# EasyEDA schematic SCH_10.1HD_2022-05-30.json
TITLE: Sheet_1; REV: 1.0; Date: 2022-05-30; Sheet: 1/1; Company: Your Company
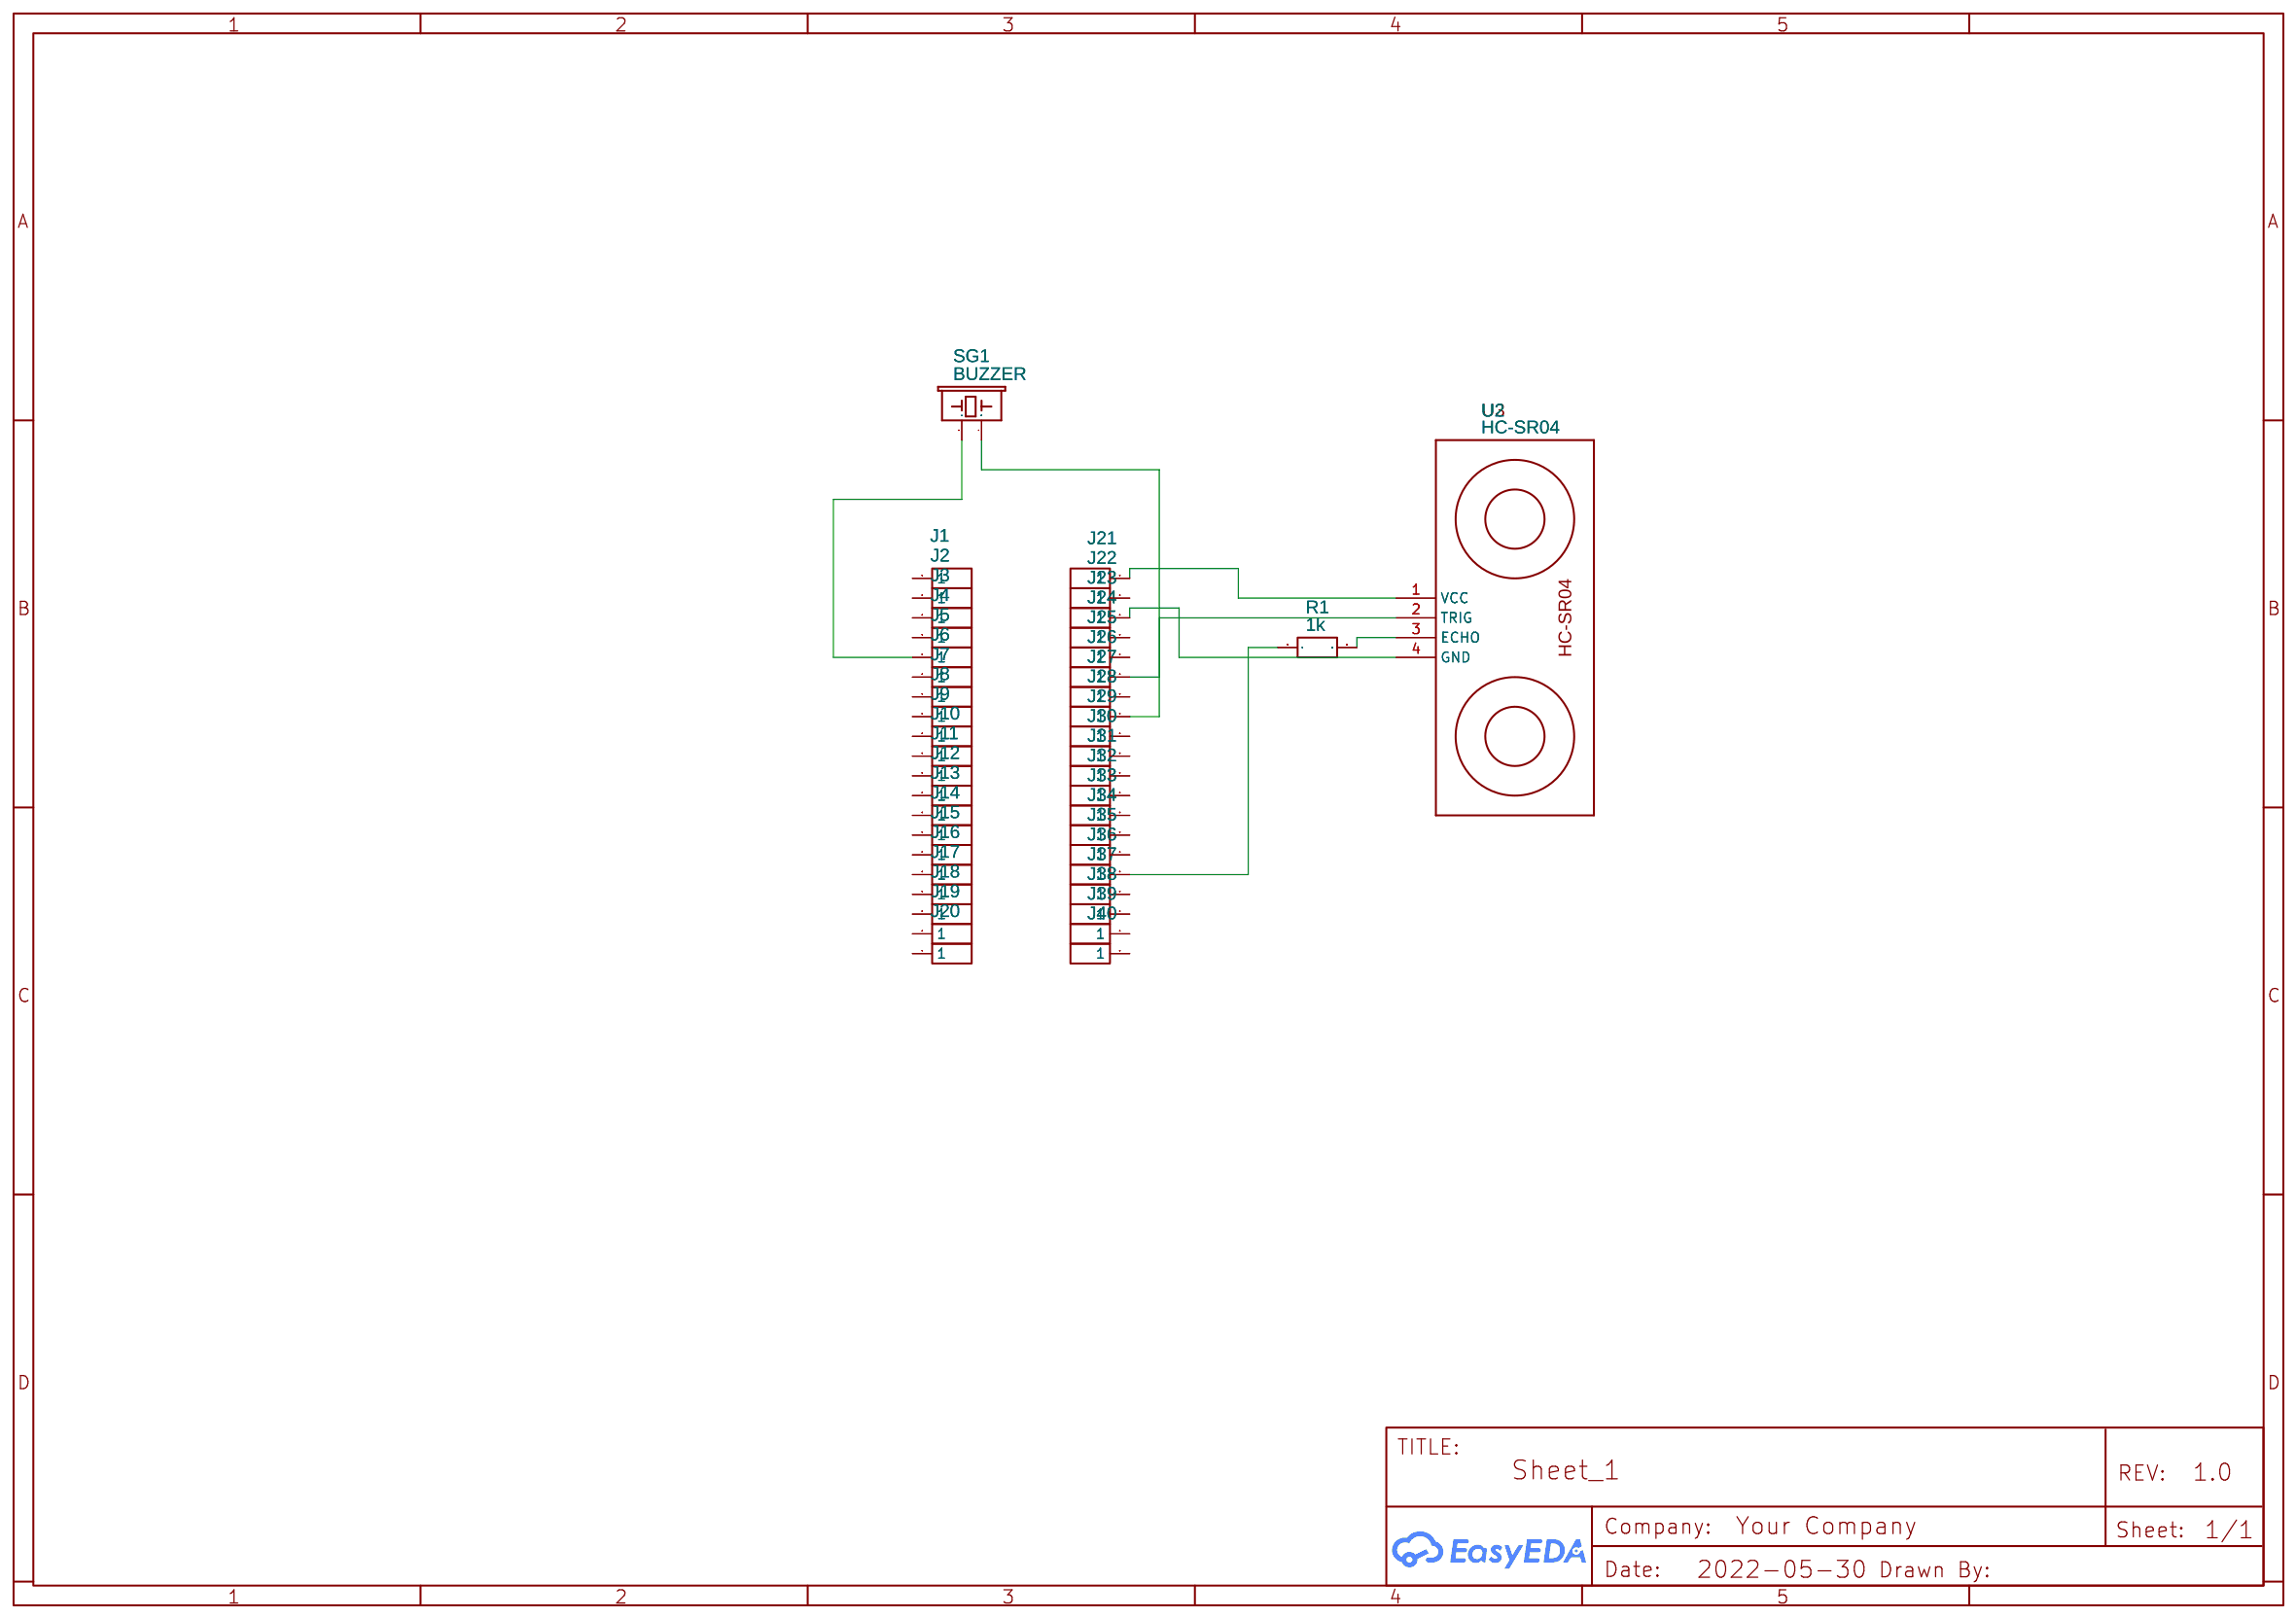
[diagram p0: schematic sheet]

## Parts
J1  HDR-M-2.54_1x1  [HDR-M-2.54_1X1]
J2  HDR-M-2.54_1x1  [HDR-M-2.54_1X1]
J3  HDR-M-2.54_1x1  [HDR-M-2.54_1X1]
J4  HDR-M-2.54_1x1  [HDR-M-2.54_1X1]
J5  HDR-M-2.54_1x1  [HDR-M-2.54_1X1]
J6  HDR-M-2.54_1x1  [HDR-M-2.54_1X1]
J7  HDR-M-2.54_1x1  [HDR-M-2.54_1X1]
J8  HDR-M-2.54_1x1  [HDR-M-2.54_1X1]
J9  HDR-M-2.54_1x1  [HDR-M-2.54_1X1]
J10  HDR-M-2.54_1x1  [HDR-M-2.54_1X1]
J11  HDR-M-2.54_1x1  [HDR-M-2.54_1X1]
J12  HDR-M-2.54_1x1  [HDR-M-2.54_1X1]
J13  HDR-M-2.54_1x1  [HDR-M-2.54_1X1]
J14  HDR-M-2.54_1x1  [HDR-M-2.54_1X1]
J15  HDR-M-2.54_1x1  [HDR-M-2.54_1X1]
J16  HDR-M-2.54_1x1  [HDR-M-2.54_1X1]
J17  HDR-M-2.54_1x1  [HDR-M-2.54_1X1]
J18  HDR-M-2.54_1x1  [HDR-M-2.54_1X1]
J19  HDR-M-2.54_1x1  [HDR-M-2.54_1X1]
J20  HDR-M-2.54_1x1  [HDR-M-2.54_1X1]
J21  HDR-M-2.54_1x1  [HDR-M-2.54_1X1]
J22  HDR-M-2.54_1x1  [HDR-M-2.54_1X1]
J23  HDR-M-2.54_1x1  [HDR-M-2.54_1X1]
J24  HDR-M-2.54_1x1  [HDR-M-2.54_1X1]
J25  HDR-M-2.54_1x1  [HDR-M-2.54_1X1]
J26  HDR-M-2.54_1x1  [HDR-M-2.54_1X1]
J27  HDR-M-2.54_1x1  [HDR-M-2.54_1X1]
J28  HDR-M-2.54_1x1  [HDR-M-2.54_1X1]
J29  HDR-M-2.54_1x1  [HDR-M-2.54_1X1]
J30  HDR-M-2.54_1x1  [HDR-M-2.54_1X1]
J31  HDR-M-2.54_1x1  [HDR-M-2.54_1X1]
J32  HDR-M-2.54_1x1  [HDR-M-2.54_1X1]
J33  HDR-M-2.54_1x1  [HDR-M-2.54_1X1]
J34  HDR-M-2.54_1x1  [HDR-M-2.54_1X1]
J35  HDR-M-2.54_1x1  [HDR-M-2.54_1X1]
J36  HDR-M-2.54_1x1  [HDR-M-2.54_1X1]
J37  HDR-M-2.54_1x1  [HDR-M-2.54_1X1]
J38  HDR-M-2.54_1x1  [HDR-M-2.54_1X1]
J39  HDR-M-2.54_1x1  [HDR-M-2.54_1X1]
J40  HDR-M-2.54_1x1  [HDR-M-2.54_1X1]
R1  1k  [R0603]
SG1  BUZZER  [BUZZER-12MM-NS-KIT]
U2  HC-SR04  [HC-SR04]

## Library data of the parts
J1-J40 = HDR-M-2.54_1x1: Supplier Part: C81276; Supplier: LCSC; Contributor: LCEDA_Lib
R1 = R_0603_EU: Contributor: LCEDA_Lib
SG1 = BUZZER: Contributor: SparkFun
U2 = HC-SR04: Manufacturer Part: ServoMotor; Contributor: srimbey

## Nets
Net-(J5-1): J5.1 SG1.+(1)
Net-(J21-1): J21.1 U2.1(VCC)
Net-(J23-1): J23.1 U2.4(GND)
Net-(J26-1): J26.1 U2.2(TRIG)
Net-(J28-1): J28.1 SG1.-(2)
Net-(J36-1): J36.1 R1.1
Net-(R1-2): R1.2 U2.3(ECHO)

Not connected (* = marked no-connect by the designer): J1 1; J2 1; J3 1; J4 1; J6 1; J7 1; J8 1; J9 1; J10 1; J11 1; J12 1; J13 1; J14 1; J15 1; J16 1; J17 1; J18 1; J19 1; J20 1; J22 1; J24 1; J25 1; J27 1; J29 1; J30 1; J31 1; J32 1; J33 1; J34 1; J35 1; J37 1; J38 1; J39 1; J40 1
